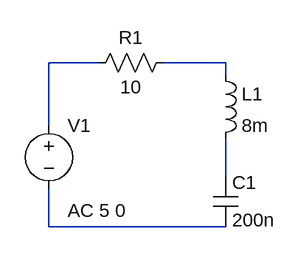
[diagram p0: schematic dop_3.asc]
dop_3.asc, the LTspice schematic file:
Version 4
SHEET 1 880 680
WIRE 144 48 80 48
WIRE 304 48 224 48
WIRE 304 64 304 48
WIRE 80 128 80 48
WIRE 304 192 304 144
WIRE 80 256 80 208
WIRE 304 256 80 256
SYMBOL voltage 80 112 R0
WINDOW 123 24 124 Left 2
WINDOW 39 0 0 Left 0
SYMATTR InstName V1
SYMATTR Value ""
SYMATTR Value2 AC 5 0
SYMBOL res 240 32 R90
WINDOW 0 0 56 VBottom 2
WINDOW 3 32 56 VTop 2
SYMATTR InstName R1
SYMATTR Value 10
SYMBOL ind 288 48 R0
SYMATTR InstName L1
SYMATTR Value 8m
SYMBOL cap 288 192 R0
SYMATTR InstName C1
SYMATTR Value 200n

The netlist it stands for:
* dop_3.asc
V1 N001 N004 AC 5 0
R1 N002 N001 10
L1 N002 N003 8m
C1 N003 N004 200n
.backanno
.end